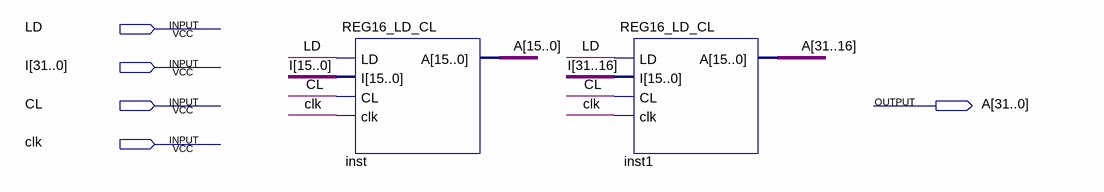
[diagram p0: schematic sheet]
// Quartus schematic REG32_LD_CL.bdf as structural Verilog: 2 symbols, 5 pins
module REG32_LD_CL (
  input  LD,
  input  [31:0] I,
  input  CL,
  input  clk,
  output [31:0] A
);

  REG16_LD_CL inst (.LD(LD), .I(I[15:0]), .CL(CL), .clk(clk), .A(A[15:0]));
  REG16_LD_CL inst1 (.LD(LD), .I(I[31:16]), .CL(CL), .clk(clk), .A(A[31:16]));
endmodule
